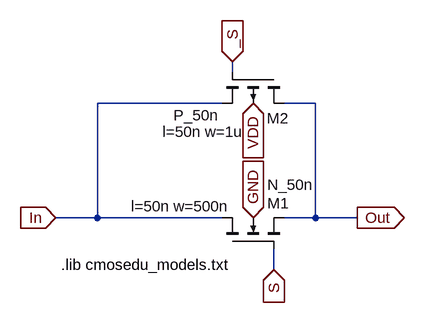
[diagram p0: schematic TG_20_10.asc]
TG_20_10.asc, the LTspice schematic file:
Version 4
SHEET 1 1136 680
WIRE 192 -112 128 -112
WIRE 192 -112 192 -288
WIRE 384 -288 192 -288
WIRE 384 -112 192 -112
WIRE 400 -336 400 -352
WIRE 464 -32 464 -64
WIRE 528 -288 480 -288
WIRE 528 -112 480 -112
WIRE 528 -112 528 -288
WIRE 592 -112 528 -112
FLAG 128 -112 In
IOPIN 128 -112 In
FLAG 592 -112 Out
IOPIN 592 -112 Out
FLAG 400 -352 _S
IOPIN 400 -352 In
FLAG 464 -32 S
IOPIN 464 -32 In
FLAG 432 -288 VDD
IOPIN 432 -288 In
FLAG 432 -112 GND
IOPIN 432 -112 In
SYMBOL nmos4 384 -64 R270
WINDOW 0 70 70 VRight 0
WINDOW 3 99 70 VRight 0
WINDOW 123 66 -140 VRight 0
SYMATTR InstName M1
SYMATTR Value N_50n
SYMATTR Value2 l=50n w=500n
SYMBOL pmos4 480 -336 R90
WINDOW 0 71 -7 VRight 0
WINDOW 3 66 101 VRight 0
WINDOW 123 92 62 VRight 0
SYMATTR InstName M2
SYMATTR Value P_50n
SYMATTR Value2 l=50n w=1u
TEXT 136 -40 Left 0 !.lib cmosedu_models.txt

The netlist it stands for:
* TG_20_10.asc
M1 In S Out GND N_50n l=50n w=500n
M2 Out _S In VDD P_50n l=50n w=1u
.model NMOS NMOS
.model PMOS PMOS
.lib standard.mos
.lib cmosedu_models.txt
.backanno
.end